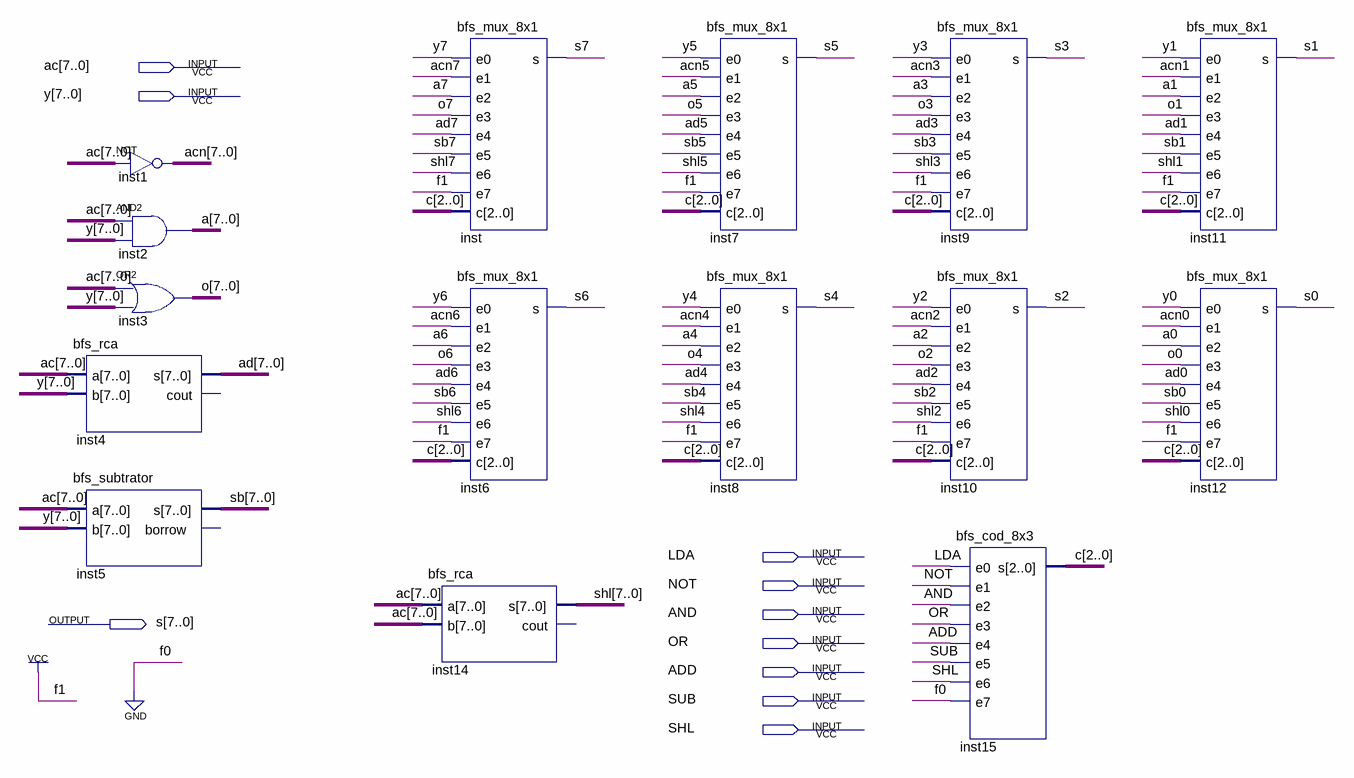
[diagram p0: schematic sheet]
// Quartus schematic bfs_ula.bdf as structural Verilog: 15 symbols, 10 pins
module bfs_ula (
  input  [7:0] ac,
  input  [7:0] y,
  input  LDA,
  input  NOT,
  input  AND,
  input  OR,
  input  ADD,
  input  SUB,
  input  SHL,
  output [7:0] s
);

  wire [2:0] c;
  wire [7:0] a, acn, ad, o, sb, SHL_bus;

  assign acn = ~ac;  // NOT inst1, 8 bits wide
  assign a = ac & y;  // AND2 inst2, 8 bits wide
  assign o = ac | y;  // OR2 inst3, 8 bits wide
  bfs_rca inst4 (.a(ac), .b(y), .s(ad));  // open: cout
  bfs_subtrator inst5 (.a(ac), .b(y), .s(sb));  // open: borrow
  bfs_rca inst14 (.a(ac), .b(ac), .s(SHL_bus));  // open: cout
  bfs_mux_8x1 inst (
    .e0(y[7]), .e1(acn[7]), .e2(a[7]), .e3(o[7]), .e4(ad[7]), .e5(sb[7]), .e6(SHL_bus[7]), .e7(1'b1), .c(c),
    .s(s[7]));
  bfs_mux_8x1 inst6 (
    .e0(y[6]), .e1(acn[6]), .e2(a[6]), .e3(o[6]), .e4(ad[6]), .e5(sb[6]), .e6(SHL_bus[6]), .e7(1'b1), .c(c),
    .s(s[6]));
  bfs_mux_8x1 inst7 (
    .e0(y[5]), .e1(acn[5]), .e2(a[5]), .e3(o[5]), .e4(ad[5]), .e5(sb[5]), .e6(SHL_bus[5]), .e7(1'b1), .c(c),
    .s(s[5]));
  bfs_mux_8x1 inst8 (
    .e0(y[4]), .e1(acn[4]), .e2(a[4]), .e3(o[4]), .e4(ad[4]), .e5(sb[4]), .e6(SHL_bus[4]), .e7(1'b1), .c(c),
    .s(s[4]));
  bfs_mux_8x1 inst9 (
    .e0(y[3]), .e1(acn[3]), .e2(a[3]), .e3(o[3]), .e4(ad[3]), .e5(sb[3]), .e6(SHL_bus[3]), .e7(1'b1), .c(c),
    .s(s[3]));
  bfs_mux_8x1 inst10 (
    .e0(y[2]), .e1(acn[2]), .e2(a[2]), .e3(o[2]), .e4(ad[2]), .e5(sb[2]), .e6(SHL_bus[2]), .e7(1'b1), .c(c),
    .s(s[2]));
  bfs_cod_8x3 inst15 (.e0(LDA), .e1(NOT), .e2(AND), .e3(OR), .e4(ADD), .e5(SUB), .e6(SHL), .e7(1'b0), .s(c));
  bfs_mux_8x1 inst11 (
    .e0(y[1]), .e1(acn[1]), .e2(a[1]), .e3(o[1]), .e4(ad[1]), .e5(sb[1]), .e6(SHL_bus[1]), .e7(1'b1), .c(c),
    .s(s[1]));
  bfs_mux_8x1 inst12 (
    .e0(y[0]), .e1(acn[0]), .e2(a[0]), .e3(o[0]), .e4(ad[0]), .e5(sb[0]), .e6(SHL_bus[0]), .e7(1'b1), .c(c),
    .s(s[0]));
endmodule
